# EAGLE design Main (EAGLE 7.2.0)
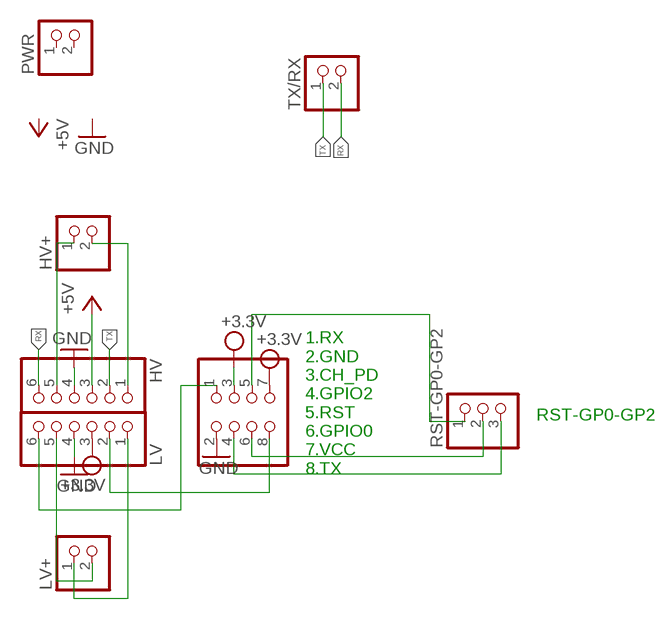
[diagram p0: schematic, sheet 1]

## Parts
HV  PINHD-1X6  [1X06]
HV+  PINHD-1X2  [1X02]
LV  PINHD-1X6  [1X06]
LV+  PINHD-1X2  [1X02]
PWR  PINHD-1X2  [1X02]
RST-GP0-GP2  PINHD-1X3  [1X03]
SOCLU_ESP  PINHD-2X4  [2X04]
TX/RX  PINHD-1X2  [1X02]

## Nets
GND: HV.4 LV.4 SOCLU_ESP.2
N$1: LV.2 SOCLU_ESP.8
N$2: RST-GP0-GP2.1 SOCLU_ESP.5
N$3: RST-GP0-GP2.2 SOCLU_ESP.6
N$4: LV.6 SOCLU_ESP.1
N$5: RST-GP0-GP2.3 SOCLU_ESP.4
N$7: HV+.1 HV.5
N$8: HV+.2 HV.1
N$9: LV+.1 LV.1
N$11: LV+.2 LV.5
RX: HV.6 TX/RX.2
TX: HV.2 TX/RX.1
VCC: HV.3 ; supply symbol labelled +5V
VDD: LV.3 SOCLU_ESP.3 SOCLU_ESP.7 ; supply symbol labelled +3.3V
Unconnected: PWR.1 PWR.2

## Notes on the sheet
- RST-GP0-GP2
- 1.RX
  2.GND
  3.CH_PD
  4.GPIO2
  5.RST
  6.GPIO0
  7.VCC
  8.TX

## Library data of the parts
HV LV = pinhead:PINHD-1X6: PIN HEADER
HV+ LV+ PWR TX/RX = pinhead:PINHD-1X2: PIN HEADER
RST-GP0-GP2 = pinhead:PINHD-1X3: PIN HEADER
SOCLU_ESP = pinhead:PINHD-2X4: PIN HEADER

## Net classes
0 default: width 0.032 mm, drill 0.032 mm

## Board
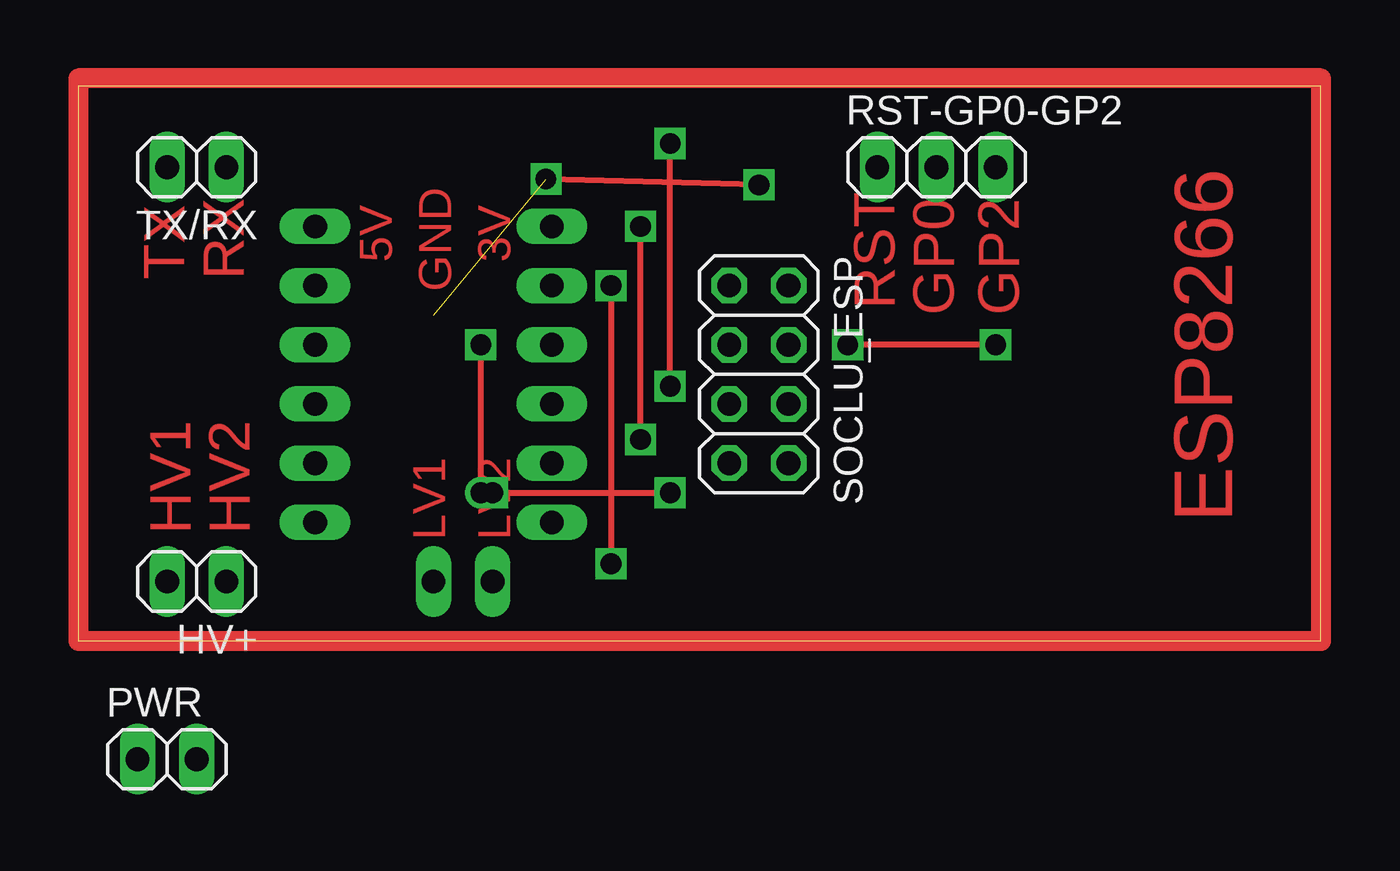
[diagram p1: board, top side]
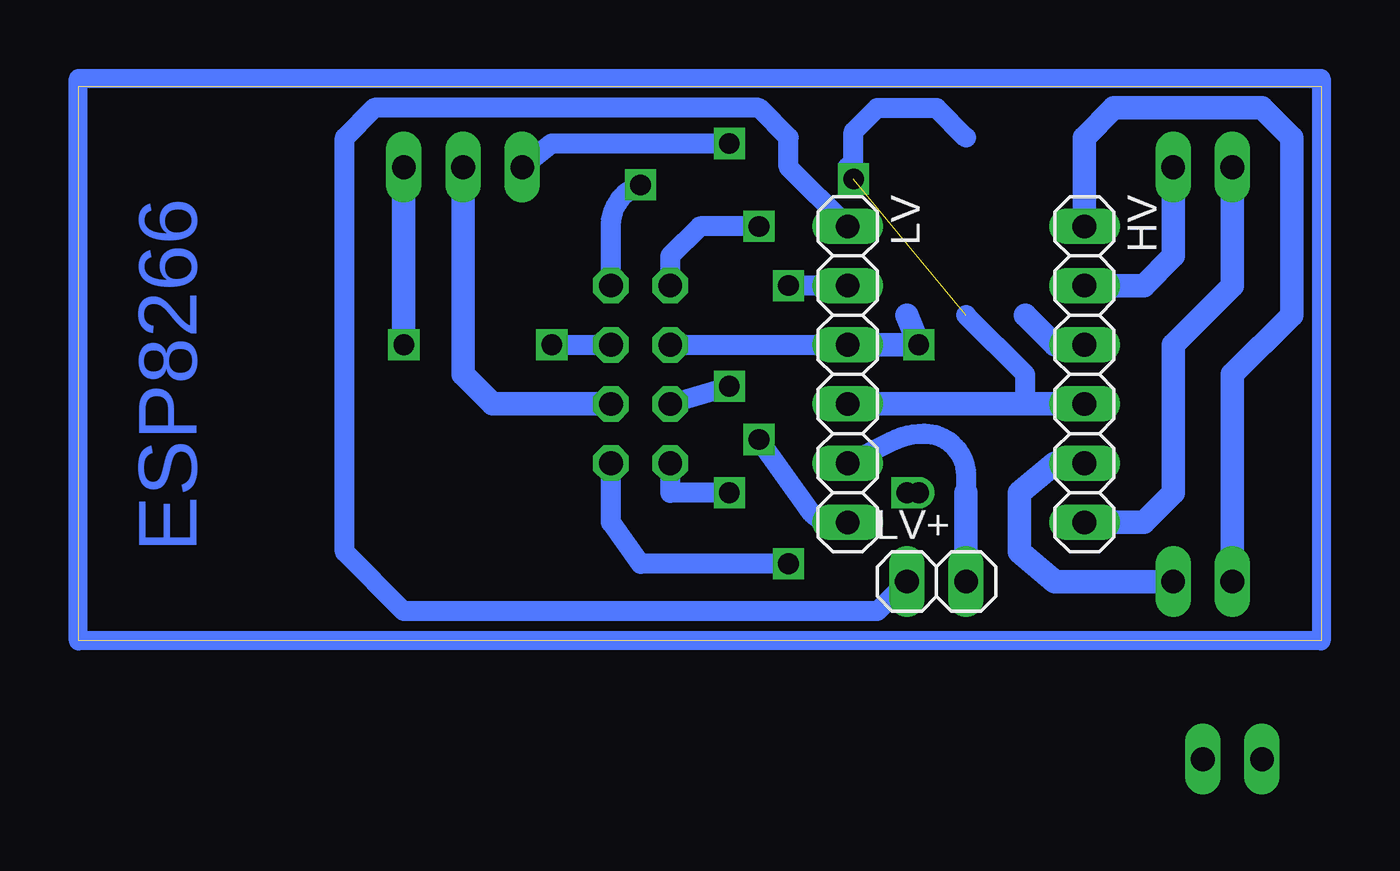
[diagram p2: board, bottom side, seen from below]

Size 53.32 x 23.8 mm. Coordinates in mm from the lower left corner, seen from the top.
Outline: 0,0 53.32,0 53.32,23.8 0,23.8 0,0
Copper layers (1*16): Top 0.035mm / dielectric 1.5mm / Bottom 0.035mm
Design rules "default *": minimum track width 34mil, minimum drill 35mil, track to track 10mil, track to pad 10mil, pad to pad 8mil, via to via 8mil, smd to smd 8mil, copper to edge 40mil, drill to drill 8mil, minimum pad ring 10mil, minimum via ring 8mil, stop-mask expansion 4mil, vias tented up to drill 0mil, thermal gap 10mil

### Footprints (pad centres in the part's own frame; a part is rotated, then mirrored left to right if it is on the bottom)
1X06 = drill 1.016 long: 1 -6.35,0; 2 -3.81,0; 3 -1.27,0; 4 1.27,0; 5 3.81,0; 6 6.35,0
1X02 = drill 1.016 long: 1 -1.27,0; 2 1.27,0
1X03 = drill 1.016 long: 1 -2.54,0; 2 0,0; 3 2.54,0
2X04 = drill 1.016 octagon: 1 -3.81,-1.27; 2 -3.81,1.27; 3 -1.27,-1.27; 4 -1.27,1.27; 5 1.27,-1.27; 6 1.27,1.27; 7 3.81,-1.27; 8 3.81,1.27

### Placement (x,y rotation side)
HV  10.16,11.43 270 bottom
HV+  5.08,2.54 180 top
LV  20.32,11.43 270 bottom
LV+  16.51,2.54 0 bottom
PWR  3.81,-5.08 0 top  (outside the outline)
RST-GP0-GP2  36.83,20.32 0 top
SOCLU_ESP  29.21,11.43 270 top
TX/RX  5.08,20.32 180 top

### Tracks (layer width: path | path; a pad name or v marks a point on that pad's centre or on a via)
GND  (via drill 0.89)  (1 unrouted)
  Top 0.254: v29.21,19.56 v20.07,19.81
  Bottom 0.864: 15.24,21.59 16.51,22.86 19.05,22.86 20.07,21.84 v20.07,19.81 20.32,20.32 | SOCLU_ESP.2 30.48,17.83 arc68 29.35,19.5 v29.21,19.56 | 12.7,10.16 12.7,11.43 15.24,13.97
  Bottom 1.016: HV.4 12.7,10.16 LV.4
N$1  (via drill 0.89)
  Top 0.254: v22.86,15.24 v22.86,3.3
  Bottom 0.864: LV.2 v22.86,15.24 | v22.86,3.3 29.21,3.3 30.48,5.08 SOCLU_ESP.8
N$2  (via drill 0.89)
  Top 0.254: v25.4,10.92 v25.4,21.34
  Bottom 0.864: SOCLU_ESP.5 v25.4,10.92 | v25.4,21.34 33.02,21.34 RST-GP0-GP2.1
N$3
  Bottom 1.016: RST-GP0-GP2.2 36.83,11.43 35.56,10.16 SOCLU_ESP.6
N$4  (via drill 0.89)
  Top 0.254: v24.13,8.64 v24.13,17.78
  Bottom 0.864: LV.6 20.94,5.08 arc54 21.97,5.61 v24.13,8.64 | v24.13,17.78 26.67,17.78 27.94,16.51 SOCLU_ESP.1
N$5  (via drill 0.89)
  Top 0.254: v39.37,12.7 v33.02,12.7
  Bottom 0.864: v33.02,12.7 SOCLU_ESP.4
  Bottom 1.016: RST-GP0-GP2.3 v39.37,12.7
N$7
  Bottom 1.016: HV+.1 11.43,2.54 12.95,3.81 12.95,6.35 11.43,7.62 HV.5
N$8
  Bottom 1.016: HV.1 10.16,21.59 8.89,22.86 2.54,22.86 1.27,21.59 1.27,13.97 3.81,11.43 HV+.2
N$9
  Bottom 0.864: LV.1 22.86,20.32 22.86,21.59 24.13,22.86 40.64,22.86 41.91,21.59 41.91,3.81 39.37,1.27 19.05,1.27 LV+.1
N$10
  Bottom 0.813: 0,24.13 0,0 53.34,0 53.34,24.13 0,24.13
N$11
  Bottom 0.864: LV.5 18.45,8.56 arc27 17.04,8.89 arc90 15.24,7.09 15.24,6.35
  Bottom 1.016: 15.24,6.35 LV+.2
N$12
  Top 0.864: 0,24.13 0,0 53.34,0 53.34,24.13 0,24.13
RX
  Bottom 1.016: TX/RX.2 3.81,15.24 6.35,12.7 6.35,6.35 7.62,5.08 HV.6
TX
  Bottom 1.016: TX/RX.1 6.35,16.51 7.62,15.24 HV.2
VCC
  Bottom 1.016: 12.7,13.97 11.43,12.7 HV.3
VDD  (via drill 0.89, 0.89 pad 0.61)
  Top 0.254: v17.78,6.35 v25.4,6.35 | v17.27,12.7 v17.27,6.35
  Top 0.864: v17.27,6.35 v17.78,6.35
  Bottom 0.864: SOCLU_ESP.7 27.94,6.35 v25.4,6.35 | SOCLU_ESP.3 LV.3
  Bottom 1.016: LV.3 v17.27,12.7 17.78,13.97

### Text on the board
Top: 5V | 3V | TX | RX | GND | RST | GP0 | GP2 | ESP8266 | HV1 | HV2 | LV1 | LV2
Bottom: ESP8266